# EAGLE schematic MUXBreakout v2 (EAGLE 9.7.0)
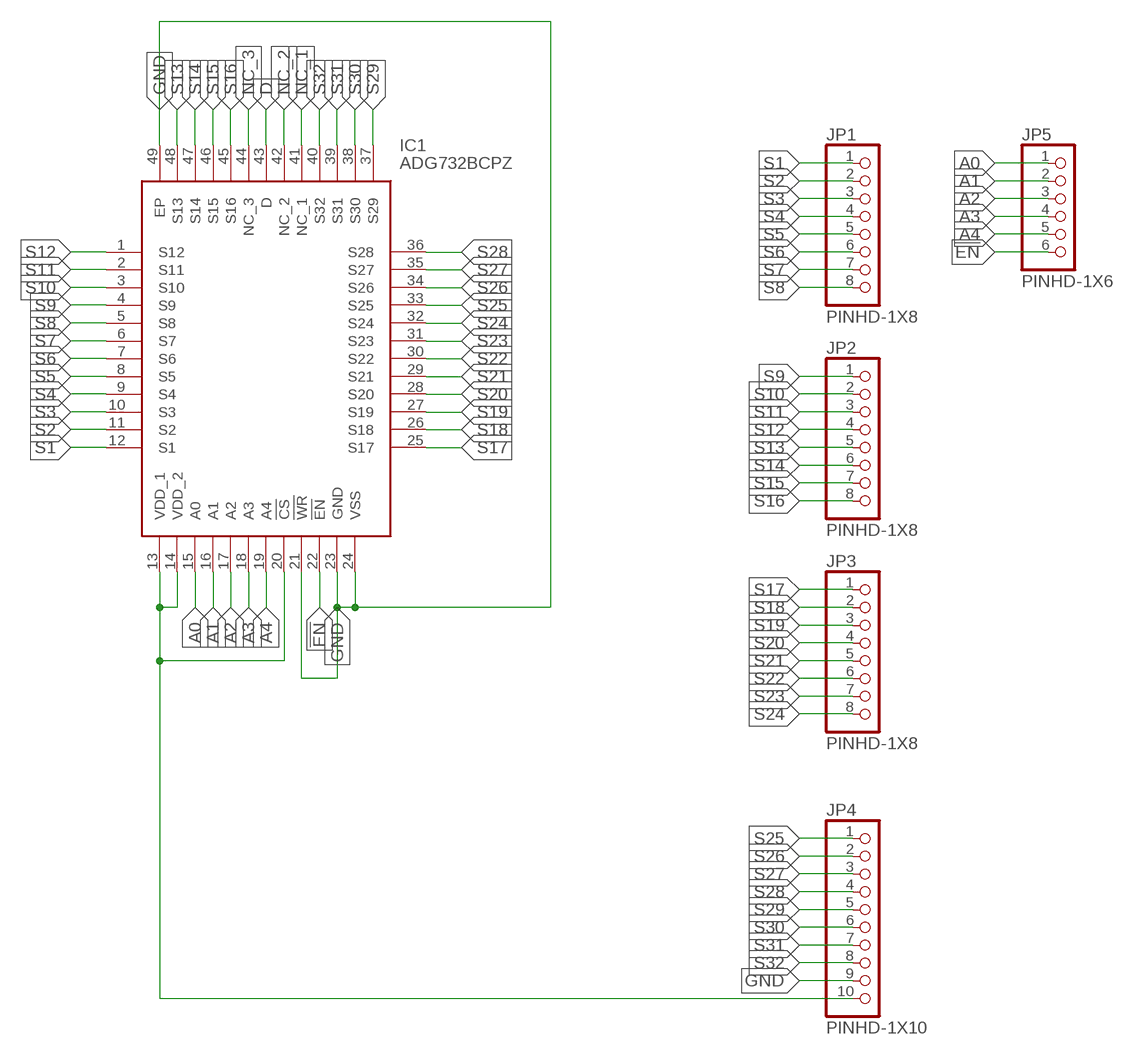
[diagram p0: schematic, sheet 1]

## Parts
IC1  ADG732BCPZ  [QFN50P700X700X100-49N]
JP1  PINHD-1X8  [1X08]
JP2  PINHD-1X8  [1X08]
JP3  PINHD-1X8  [1X08]
JP4  PINHD-1X10  [1X10]
JP5  PINHD-1X6  [1X06]

## Nets
!EN: IC1.22(!EN) JP5.6
A0: IC1.15(A0) JP5.1
A1: IC1.16(A1) JP5.2
A2: IC1.17(A2) JP5.3
A3: IC1.18(A3) JP5.4
A4: IC1.19(A4) JP5.5
D: IC1.43(D)
GND: IC1.21(!WR) IC1.23(GND) IC1.24(VSS) IC1.49(EP) JP4.9
NC_1: IC1.41(NC_1)
NC_2: IC1.42(NC_2)
NC_3: IC1.44(NC_3)
S1: IC1.12(S1) JP1.1
S2: IC1.11(S2) JP1.2
S3: IC1.10(S3) JP1.3
S4: IC1.9(S4) JP1.4
S5: IC1.8(S5) JP1.5
S6: IC1.7(S6) JP1.6
S7: IC1.6(S7) JP1.7
S8: IC1.5(S8) JP1.8
S9: IC1.4(S9) JP2.1
S10: IC1.3(S10) JP2.2
S11: IC1.2(S11) JP2.3
S12: IC1.1(S12) JP2.4
S13: IC1.48(S13) JP2.5
S14: IC1.47(S14) JP2.6
S15: IC1.46(S15) JP2.7
S16: IC1.45(S16) JP2.8
S17: IC1.25(S17) JP3.1
S18: IC1.26(S18) JP3.2
S19: IC1.27(S19) JP3.3
S20: IC1.28(S20) JP3.4
S21: IC1.29(S21) JP3.5
S22: IC1.30(S22) JP3.6
S23: IC1.31(S23) JP3.7
S24: IC1.32(S24) JP3.8
S25: IC1.33(S25) JP4.1
S26: IC1.34(S26) JP4.2
S27: IC1.35(S27) JP4.3
S28: IC1.36(S28) JP4.4
S29: IC1.37(S29) JP4.5
S30: IC1.38(S30) JP4.6
S31: IC1.39(S31) JP4.7
S32: IC1.40(S32) JP4.8
VDD_2: IC1.13(VDD_1) IC1.14(VDD_2) IC1.20(!CS) JP4.10

## Library data of the parts
IC1 = ADG732BCPZ:ADG732BCPZ: ADG732BCPZ, Analogue Switch Single 32:1, 3, 5V, 48-Pin, LFCSP EP Source: Datasheet <https://datasheet.datasheetarchive.com/originals/distributors/Datasheets-4/DSA-69835.pdf>; DESCRIPTION: ADG732BCPZ, Analogue Switch Single 32:1, 3, 5V, 48-Pin, LFCSP EP; HEIGHT: 1mm; MANUFACTURER_NAME: Analog Devices; MANUFACTURER_PART_NUMBER: ADG732BCPZ; MOUSER_PART_NUMBER: 584-ADG732BCPZ; MOUSER_PRICE-STOCK: https://www.mouser.co.uk/ProductDetail/Analog-Devices/ADG732BCPZ?qs=BpaRKvA4VqHiwXPRyuCIMA%3D%3D
JP1-JP3 = Connector:PINHD-1X8: PIN HEADER; CATEGORY: Headers; DESCRIPTION: Header, Straight, 8 Position; MANUFACTURER: Generic; MPN: Generic; OPERATING_TEMPERATURE: Generic; PART_STATUS: Active; PITCH: 0.100" (2.54mm); ROHS_COMPLIANCE: Generic; SERIES: Generic; SUB-CATEGORY: Headers, Male Pins; TYPE: Board to Board or Cable, Unshrouded, Through Hole, Straight
JP4 = Connector:PINHD-1X10: PIN HEADER; CATEGORY: Headers; DESCRIPTION: Header, Straight, 10 Position; MANUFACTURER: Generic; MPN: Generic; OPERATING_TEMPERATURE: Generic; PART_STATUS: Active; PITCH: 0.100" (2.54mm); ROHS_COMPLIANCE: Generic; SERIES: Generic; SUB-CATEGORY: Headers, Male Pins; TYPE: Board to Board or Cable, Unshrouded, Through Hole, Straight
JP5 = Connector:PINHD-1X6: PIN HEADER; CATEGORY: Headers; DESCRIPTION: Header, Straight, 6 Position; MANUFACTURER: Generic; MPN: Generic; OPERATING_TEMPERATURE: Generic; PART_STATUS: Active; PITCH: 0.100" (2.54mm); ROHS_COMPLIANCE: Generic; SERIES: Generic; SUB-CATEGORY: Headers, Male Pins; TYPE: Board to Board or Cable, Unshrouded, Through Hole, Straight